# EAGLE design Shield (EAGLE 9.6.2)
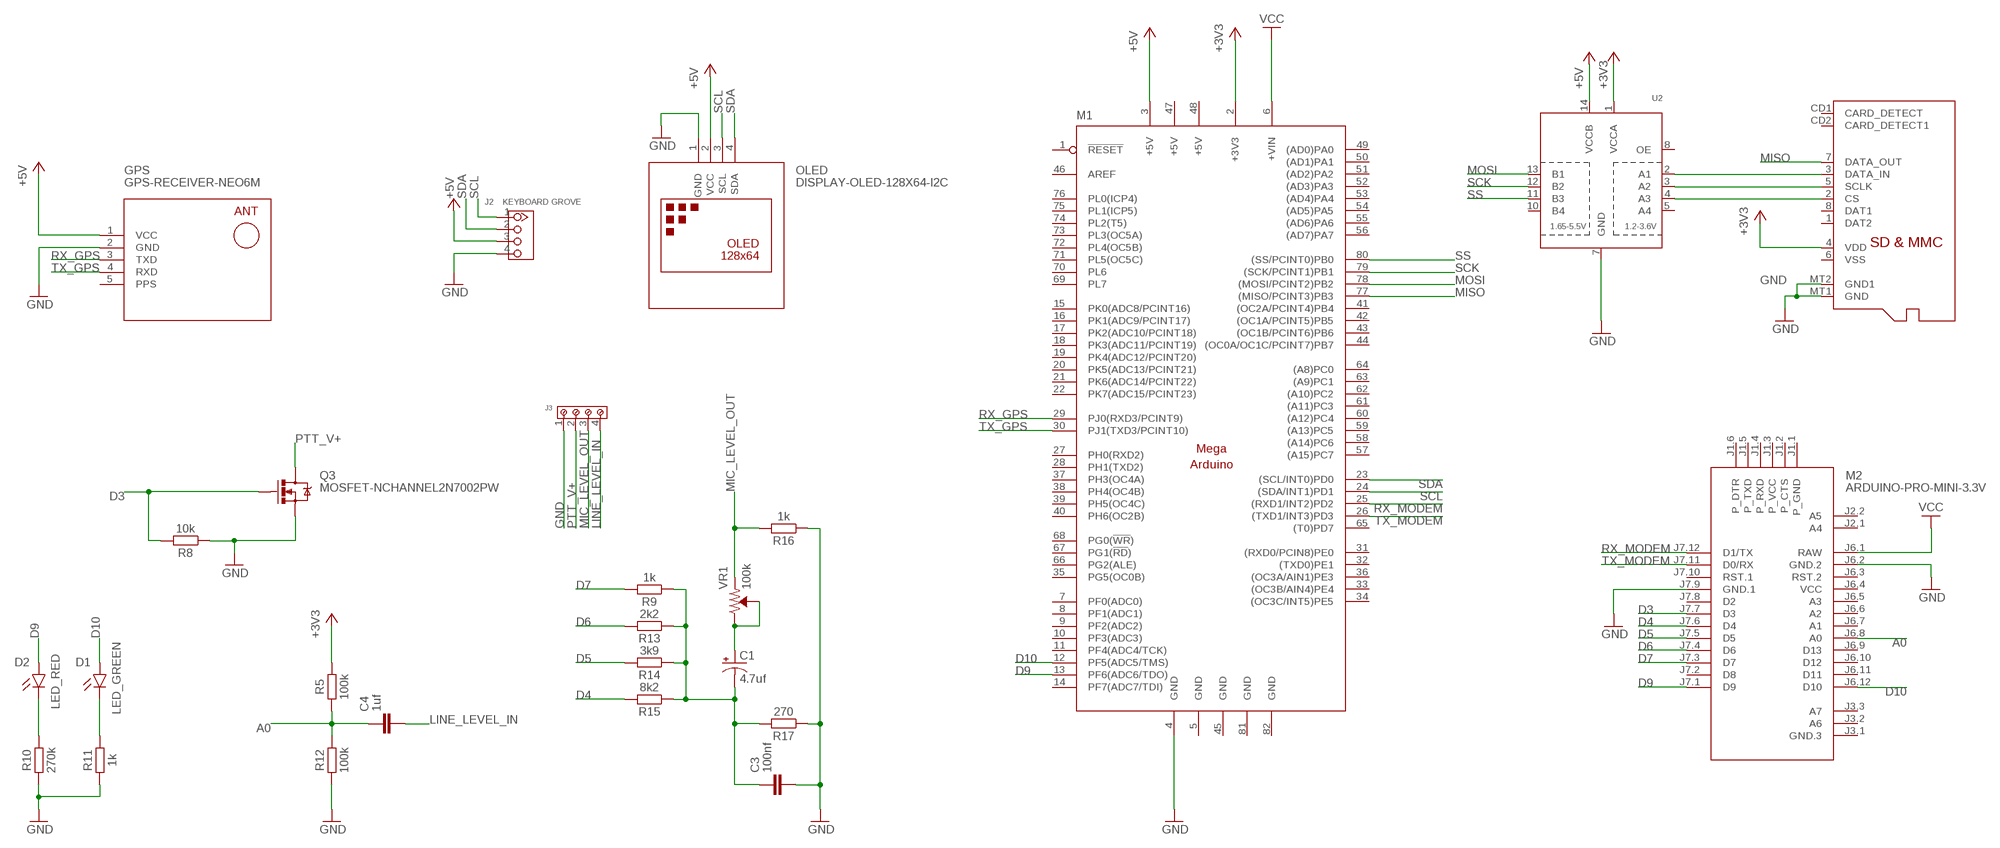
[diagram p0: schematic, sheet 1]

## Parts
C1  4.7uf  CPOL-USCT3528  [CT3528]
C3  100nf  C_CHIP-0805(2012-METRIC)  [CAPC2012X110]
C4  1uf  C_CHIP-0805(2012-METRIC)  [CAPC2012X110]
D1  LED_GREEN  CHIP-ROUND-R_0805  [LEDC2012X105N_RND-R]
D2  LED_RED  CHIP-ROUND-R_0805  [LEDC2012X105N_RND-R]
GPS  GPS-RECEIVER-NEO6M  [GPS-RECEIVER-NEO6M]
J2  KEYBOARD GROVE  GROVE-CONNECTOR-DIP-90D(4P-2.0)  [HW4-2.0-90D]
J3  691210910004  [691210910004]
M1  MEGAARDUINO_1  [MEGA_ARDUINO]
M2  ARDUINO-PRO-MINI-3.3V  [ARDUINO-PRO-MINI]
OLED  DISPLAY-OLED-128X64-I2C  [DISPLAY-OLED-128X64-I2C]
Q3  MOSFET-NCHANNEL2N7002PW  [SOT323]
R5  100k  R_CHIP-0805(2012-METRIC)  [RESC2012X65]
R8  10k  R_CHIP-0805(2012-METRIC)  [RESC2012X65]
R9  1k  R_CHIP-0805(2012-METRIC)  [RESC2012X65]
R10  270k  R_CHIP-0805(2012-METRIC)  [RESC2012X65]
R11  1k  R_CHIP-0805(2012-METRIC)  [RESC2012X65]
R12  100k  R_CHIP-0805(2012-METRIC)  [RESC2012X65]
R13  2k2  R_CHIP-0805(2012-METRIC)  [RESC2012X65]
R14  3k9  R_CHIP-0805(2012-METRIC)  [RESC2012X65]
R15  8k2  R_CHIP-0805(2012-METRIC)  [RESC2012X65]
R16  1k  R_CHIP-0805(2012-METRIC)  [RESC2012X65]
R17  270  R_CHIP-0805(2012-METRIC)  [RESC2012X65]
SD  MICROSD  [MICROSD]
U2  TXB0104PWR  [TSSOP14]
VR1  100k  TRIMPOT-SMD-3MM-CLOSED-1/8W-20%  [TRIMPOT-SMD-3MM-CLOSED]

## Nets
+3V3: M1.2(+3V3) R5.2 SD.4(VDD) U2.1(VCCA)
+5V: GPS.1(VCC) J2.3 M1.3(+5V) OLED.2(VCC) U2.14(VCCB)
A0: C4.1 M2.J6.8(A0) R5.1 R12.2
D3: M2.J7.7(D3) Q3.1(G) R8.2
D4: M2.J7.6(D4) R15.2
D5: M2.J7.5(D5) R14.2
D6: M2.J7.4(D6) R13.2
D7: M2.J7.3(D7) R9.2
D9: D2.A M1.13(PF6(ADC6/TDO)) M2.J7.1(D9)
D10: D1.A M1.12(PF5(ADC5/TMS)) M2.J6.12(D10)
GND: C3.2 GPS.2(GND) J2.4 J3.1 M1.4(GND) M2.J6.2(GND.2) M2.J7.9(GND.1) OLED.1(GND) Q3.2(S) R8.1 R10.1 R11.1 R12.1 R16.1 R17.1 SD.MT1(GND) SD.MT2(GND1) U2.7(GND)
LINE_LEVEL_IN: C4.2 J3.4
LINE_LEVEL_OUT: C1.+ VR1.2(WIPER) VR1.3(CW)
MIC_LEVEL_OUT: J3.3 R16.2 VR1.1(CCW)
MISO: M1.77((MISO/PCINT3)PB3) SD.7(DATA_OUT)
MOSI: M1.78((MOSI/PCINT2)PB2) U2.13(B1)
N$1: SD.3(DATA_IN) U2.2(A1)
N$2: C1.- C3.1 R9.1 R13.1 R14.1 R15.1 R17.2
N$3: D2.C R10.2
N$4: D1.C R11.2
N$5: SD.5(SCLK) U2.3(A2)
N$6: SD.2(CS) U2.4(A3)
PTT_V+: J3.2 Q3.3(D)
RX_GPS: GPS.3(TXD) M1.29(PJ0(RXD3/PCINT9))
RX_MODEM: M1.25((RXD1/INT2)PD2) M2.J7.12(D1/TX)
SCK: M1.79((SCK/PCINT1)PB1) U2.12(B2)
SCL: J2.1 M1.24((SDA/INT1)PD1) OLED.3(SCL)
SDA: J2.2 M1.23((SCL/INT0)PD0) OLED.4(SDA)
SS: M1.80((SS/PCINT0)PB0) U2.11(B3)
TX_GPS: GPS.4(RXD) M1.30(PJ1(TXD3/PCINT10))
TX_MODEM: M1.26((TXD1/INT3)PD3) M2.J7.11(D0/RX)
VCC: M1.6(+VIN) M2.J6.1(RAW)
Unconnected: M1.1(!RESET) M1.7(PF0(ADC0)) M1.8(PF1(ADC1)) M1.9(PF2(ADC2)) M1.10(PF3(ADC3)) M1.11(PF4(ADC4/TCK)) M1.14(PF7(ADC7/TDI)) M1.15(PK0(ADC8/PCINT16)) M1.16(PK1(ADC9/PCINT17)) M1.17(PK2(ADC10/PCINT18)) M1.18(PK3(ADC11/PCINT19)) M1.19(PK4(ADC12/PCINT20)) M1.20(PK5(ADC13/PCINT21)) M1.21(PK6(ADC14/PCINT22)) M1.22(PK7(ADC15/PCINT23)) M1.27(PH0(RXD2)) M1.28(PH1(TXD2)) M1.31((RXD0/PCIN8)PE0) M1.32((TXD0)PE1) M1.33((OC3B/AIN4)PE4) M1.34((OC3C/INT5)PE5) M1.35(PG5(OC0B)) M1.36((OC3A/AIN1)PE3) M1.37(PH3(OC4A)) M1.38(PH4(OC4B)) M1.39(PH5(OC4C)) M1.40(PH6(OC2B)) M1.41((OC2A/PCINT4)PB4) M1.42((OC1A/PCINT5)PB5) M1.43((OC1B/PCINT6)PB6) M1.44((OC0A/OC1C/PCINT7)PB7) M1.46(AREF) M1.49((AD0)PA0) M1.50((AD1)PA1) M1.51((AD2)PA2) M1.52((AD3)PA3) M1.53((AD4)PA4) M1.54((AD5)PA5) M1.55((AD6)PA6) M1.56((AD7)PA7) M1.57((A15)PC7) M1.58((A14)PC6) M1.59((A13)PC5) M1.60((A12)PC4) M1.61((A11)PC3) M1.62((A10)PC2) M1.63((A9)PC1) M1.64((A8)PC0) M1.65((T0)PD7) M1.66(PG2(ALE)) M1.67(PG1(!RD!)) M1.68(PG0(!WR!)) M1.69(PL7) M1.70(PL6) M1.71(PL5(OC5C)) M1.72(PL4(OC5B)) M1.73(PL3(OC5A)) M1.74(PL2(T5)) M1.75(PL1(ICP5)) M1.76(PL0(ICP4)) M2.J1.1(P_GND) M2.J1.2(P_CTS) M2.J1.3(P_VCC) M2.J1.4(P_RXD) M2.J1.5(P_TXD) M2.J1.6(P_DTR) M2.J2.1(A4) M2.J2.2(A5) M2.J3.1(GND.3) M2.J3.2(A6) M2.J3.3(A7) M2.J6.3(RST.2) M2.J6.5(A3) M2.J6.6(A2) M2.J6.7(A1) M2.J6.9(D13) M2.J6.10(D12) M2.J6.11(D11) M2.J7.2(D8) M2.J7.8(D2) M2.J7.10(RST.1) SD.1(DAT2) SD.6(VSS) SD.8(DAT1) SD.CD1(CARD_DETECT) SD.CD2(CARD_DETECT1) U2.5(A4) U2.8(OE) U2.10(B4)

## Power pins joined to a net without a drawn wire
+5V: M1.47(+5V) M1.48(+5V)
GND: M1.5(GND) M1.45(GND) M1.81(GND) M1.82(GND)
PPS: GPS.5(PPS)
VCC: M2.J6.4(VCC)

## Library data of the parts
C1 = adafruit:CPOL-US: POLARIZED CAPACITOR, American symbol
C3 C4 = Capacitor:C: Capacitor - Generic; CATEGORY: Capacitor
D1 = LED:CHIP-ROUND-R: LED - Generic; CATEGORY: LED; COLOR: RED; DESCRIPTION: CHIP LED ROUND; SUB-CATEGORY: CHIP; TYPE: ROUND_TOP; VALUE: LED_RED
D2 = LED:CHIP-ROUND-R: LED - Generic; CATEGORY: LED; COLOR: RED; DESCRIPTION: CHIP LED ROUND; SUB-CATEGORY: CHIP; TYPE: ROUND_TOP
GPS = diy-modules:GPS-RECEIVER-NEO6M: GPS Receiver Module based on NEO-6 device Short tutorial how to use NEO-6 module with Arduino: http://www.xarg.org/2016/06/neo6mv2-gps-module-with-arduino/ NEO-6 datasheet is available here: https://www.u-blox.com/sites/default/files/products/documents/NEO-6_DataSheet_%28GPS.G6-HW-09005%29.pdf Click here to find device on ebay.com <http://www.ebay.com/sch/gyneo6mv2>
J2 = OPL_Connector:GROVE-CONNECTOR-DIP-90D(4P-2.0): 320110034; VALUE: 4P-2.0-90D
J3 = Wurth_Connectors_WR-TBL Rising Cage Clamp:691210910004: WR-TBL Serie 2109 - 2.54 mm Horiz. Entry KIND PROPERTIES Pitch 2.54 mm MATERIAL PROPERTIES Insulator Material PA66 Insulator Flammability Rating UL94 V-0 Insulator Color Green Contact Material Brass Contact Plating Copper over Zinc Terminal Screw Material Steel Terminal Screw Plating Zinc Wire Guard Material Brass GENERAL INFORMATION Operating Temperature -40 up to +105 °C Compliance Lead free / RoHS ELECTRICAL PROPERTIES IR cULus 6 A Working Voltage [cULus] 150 V (AC) Withstanding Voltage [cULus] 1300 V (AC) Contact Resistance [cULus] 20 mΩ MECHANICAL PROPERTIES Wire Strip Length 4 up to 5 (mm) Screw M1.6 Solid Wire Section (AWG) 30 to 18 (AWG) Solid Wire Section (Metric) 0.0509 to 0.823 (mm²) Stranded Wire Section (AWG) 30 to 18 (AWG) Stranded Wire Section (Metric) 0.0509 to 0.823 (mm²) CERTIFICATION cULus Approval E315414 PACKAGING PROPERTIES Packaging Box <https://katalog.we-online.com/media/images/v2/o33231v209%20Family_WR-TBL_69121091000x.jpg> Details see: https://katalog.we-online.com/en/em/TBL_2_54_2109_HORIZONTAL_ENTRY_69121091000X Updated by Ella Wu 2019-11-12 2019(C) Wurth Elektronik; DATASHEET-URL: https://www.we-online.com/catalog/datasheet/691210910004.pdf; IR-UL: 6A; MOUNT: THT; PART-NUMBER: 691210910004; PINS: 4; PITCH: 2.54mm; TYPE: Horizontal; WIRE: 30 to 18 (AWG) 0.0509 to 0.823 (mm²); WORKING-VOLTAGE-UL: 150V (AC)
M1 = arduino:MEGAARDUINO_1: The Arduino Mega is a microcontroller board based on the ATmega1280. - 54 digital input/output pins (of which 14 can be used as PWM outputs) - 16 analog inputs - 4 UARTs (hardware serial ports) - 16 MHz crystal oscillator - USB connection - power jack - ICSP header - reset button It contains everything needed to support the microcontroller; simply connect it to a computer with a USB cable or power it with a AC-to-DC adapter or battery to get started. The Mega is compatible with most shields designed for the Arduino Duemilanove or Diecimila. http://arduino.cc/en/Main/ArduinoBoardMega
M2 = diy-modules:ARDUINO-PRO-MINI-*: Arduino Pro Mini and compatible devices More details available here: https://www.arduino.cc/en/Main/ArduinoBoardProMini Click here to find device on ebay.com <http://www.ebay.com/sch/arduino+pro+mini>
OLED = diy-modules:DISPLAY-OLED-128X64-I2C: 128x64 Dot Matrix OLED Module based on SSD1306 chip Variant with I2C interface More details available here: http://www.instructables.com/id/Monochrome-096-i2c-OLED-display-with-arduino-SSD13/ SSD1306 datasheet: https://cdn-shop.adafruit.com/datasheets/SSD1306.pdf Click here to find device on ebay.com <http://www.ebay.com/sch/oled+display+128x64+iic> Note: There are two variants: I2C and SPI. Search for the proper version.
Q3 = BeagleBone_Blue_R3:MOSFET-NCHANNEL: Common NMOSFET Parts MFG P/N Store ID Prod ID FDD8780 TRANS-09984 SI7820DN TRANS-11055 FDS6630A IC-08089 2N7002PW TRANS-11151 FQP30N06L COM-10213 TRANS-10060 BSS123LT1G TRANS-08345 BSS138 TRANS-00830 BS170 2N7000; PROD_ID: TRANS-11151
R5 R8-R17 = Resistor:R: Resistor Fixed - Generic; CATEGORY: Resistor; SUB-CATEGORY: Fixed
SD = adafruit:MICROSD: Micro-SD / Transflash card holder with SPI pinout For the 3M # 2908-05WB-MG and/or 4UCON #19656 push-push type
U2 = adafruit:TXB0104PWR: 4-Bit Bi-Directional Level Shifter 1.2V-3.6V (VCCA) to 1.65V-5.5V (VCCB) bi-directional level shifter with auto direction sensing. Max data rate - VCCA 1.8V: 20Mbps (50ns), VCCA 3.3V: 100Mbps (10ns) Digikey: 296-21929-1-ND
VR1 = SparkFun-Resistors:TRIMPOT: Trimming Potentiometer (Trimpot) Three-terminal potentiometers, with an adjustable wiper and two adjustable resistors. A pot can be used to create a configurable voltage divider, or as a variable resistor. "Trimpots" are a subset of potentiometers, usually intended for "set-and-forget" applications. They're often more delicate than standard potentiometers - rated for fewer turns. Variants PTH-KNOB - PTH Trimpot w/ finger-adjustable knob Trimpot 10K with Knob <https://www.sparkfun.com/products/9806> (COM-09806) Datasheet <http://www.sparkfun.com/datasheets/Components/General/TSR-3386.pdf> SMD-3MM-CLOSED-FRAME - SMD 3mm Square Closed-Frame Trimpot Used on e.g. EasyDriver - Stepper Motor Driver <https://www.sparkfun.com/products/12779> Datasheet <http://www.bitechnologies.com/pdfs/22.pdf> (22AR10KTR) SMD-5MM - SMD 5mm Square Closed-Frame Trimpot Used on e.g. IOIO-OTG - V2.2 <https://www.sparkfun.com/products/13613> Datasheet <http://www.vishay.com/docs/51008/ts53.pdf> (TS53YL502MR10) SMD-3MM-1/10W-25% - 3mm Square Open-Frame Trimpot Used on e.g. SparkFun Shapeoko <https://www.sparkfun.com/products/13899> Datasheet <http://www.bourns.com/docs/Product-Datasheets/TC33.pdf> (TC33X-2-103E); PROD_ID: RES-09285; VALUE: 10k

## Board
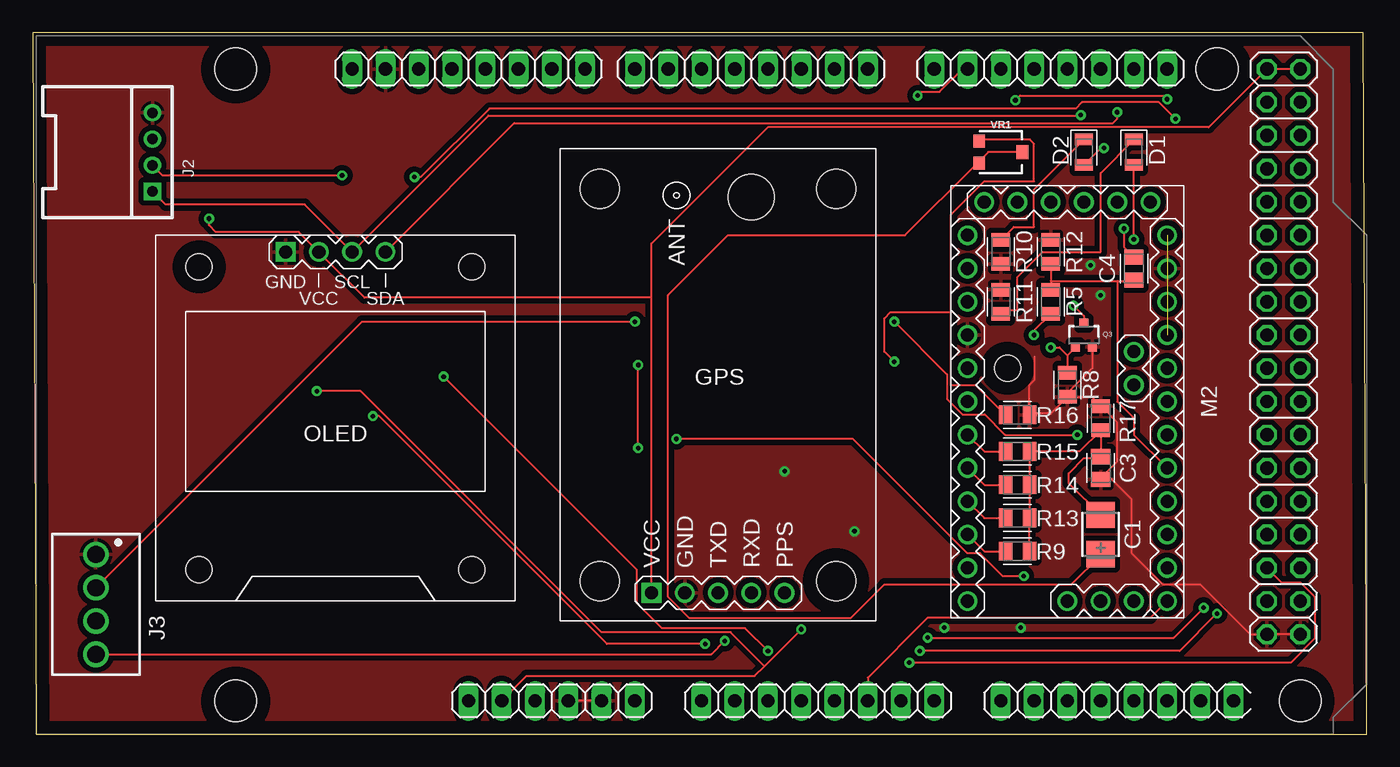
[diagram p1: board, top side]
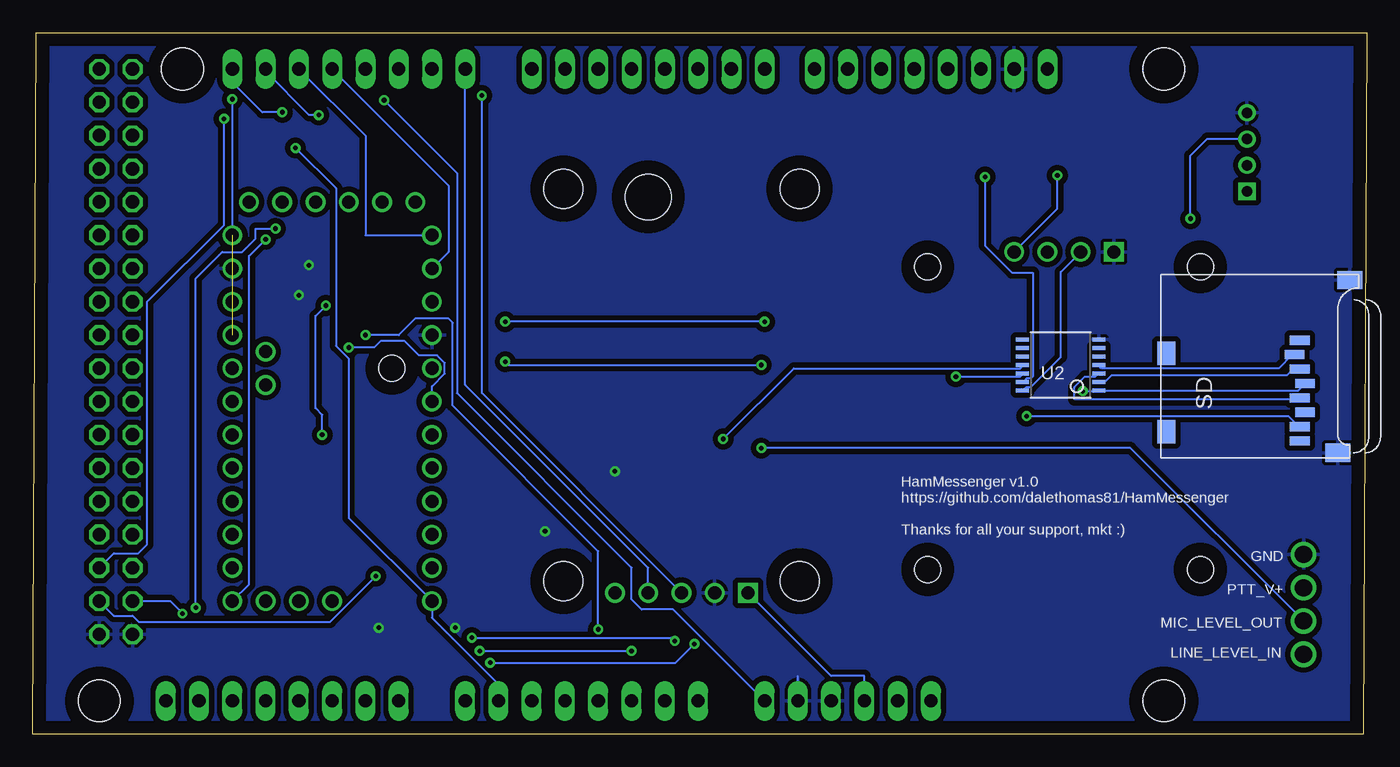
[diagram p2: board, bottom side, seen from below]

Size 101.85 x 53.57 mm. Coordinates in mm from the lower left corner, seen from the top.
Outline: 0.25,0 101.85,0 101.6,53.57 0,53.57 0.25,0
Copper layers (1*16): Top 0.035mm / dielectric 1.5mm / Bottom 0.035mm
Design rules "default": minimum track width 6mil, minimum drill 0.35mm, track to track 6mil, track to pad 6mil, pad to pad 6mil, via to via 6mil, smd to smd 6mil, copper to edge 40mil, drill to drill 6mil, minimum pad ring 10mil, minimum via ring 8mil, stop-mask expansion 4mil, vias tented up to drill 0mil, thermal gap 10mil

### Footprints (pad centres in the part's own frame; a part is rotated, then mirrored left to right if it is on the bottom)
CT3528 = smd 2 x 2.2: + 1.5,0; - -1.5,0
CAPC2012X110 = smd 1.165 x 1.465: 1 -0.875,0; 2 0.875,0
LEDC2012X105N_RND-R = smd 0.862 x 1.362: A 0.975,0; C -0.975,0
GPS-RECEIVER-NEO6M = drill 1 square: 1 -15.875,5.08 | drill 1: 2 -15.875,2.54; 3 -15.875,0; 4 -15.875,-2.54; 5 -15.875,-5.08 | hole 3: -14.986,9.017; -14.986,-9.017; 14.986,-9.017; 14.986,9.017 | hole 3.5: 14.351,-2.54
HW4-2.0-90D = drill 0.8 pad 1.27 square: 1 -3,0 | drill 0.8 pad 1.27: 2 -1,0; 3 1,0; 4 3,0
691210910004 = drill 1.3: 1 -3.81,0; 2 -1.27,0; 3 1.27,0; 4 3.81,0
MEGA_ARDUINO = drill 1.016 long: 1 33.02,2.54; 2 35.56,2.54; 3 38.1,2.54; 4 40.64,2.54; 5 43.18,2.54; 6 45.72,2.54; 7 50.8,2.54; 8 53.34,2.54; 9 55.88,2.54; 10 58.42,2.54; 11 60.96,2.54; 12 63.5,2.54; 13 66.04,2.54; 14 68.58,2.54; 15 73.66,2.54; 16 76.2,2.54; 17 78.74,2.54; 18 81.28,2.54; 19 83.82,2.54; 20 86.36,2.54; 21 88.9,2.54; 22 91.44,2.54; 23 86.36,50.8; 24 83.82,50.8; 25 81.28,50.8; 26 78.74,50.8; 27 76.2,50.8; 28 73.66,50.8; 29 71.12,50.8; 30 68.58,50.8; 31 63.5,50.8; 32 60.96,50.8; 33 58.42,50.8; 34 55.88,50.8; 35 53.34,50.8; 36 50.8,50.8; 37 48.26,50.8; 38 45.72,50.8; 39 41.91,50.8; 40 39.37,50.8; 41 36.83,50.8; 42 34.29,50.8; 43 31.75,50.8; 44 29.21,50.8; 45 26.67,50.8; 46 24.13,50.8 | drill 1.016 octagon: 47 93.98,50.8; 48 96.52,50.8; 49 93.98,48.26; 50 96.52,48.26; 51 93.98,45.72; 52 96.52,45.72; 53 93.98,43.18; 54 96.52,43.18; 55 93.98,40.64; 56 96.52,40.64; 57 93.98,38.1; 58 96.52,38.1; 59 93.98,35.56; 60 96.52,35.56; 61 93.98,33.02; 62 96.52,33.02; 63 93.98,30.48; 64 96.52,30.48; 65 93.98,27.94; 66 96.52,27.94; 67 93.98,25.4; 68 96.52,25.4; 69 93.98,22.86; 70 96.52,22.86; 71 93.98,20.32; 72 96.52,20.32; 73 93.98,17.78; 74 96.52,17.78; 75 93.98,15.24; 76 96.52,15.24; 77 93.98,12.7; 78 96.52,12.7; 79 93.98,10.16; 80 96.52,10.16; 81 93.98,7.62; 82 96.52,7.62 | hole 3.2: 15.24,50.8; 15.24,2.54; 90.17,50.8; 96.52,2.54 | hole 2: 74.168,27.94
ARDUINO-PRO-MINI = drill 1: J1.1 -15.24,6.35; J1.2 -15.24,3.81; J1.3 -15.24,1.27; J1.4 -15.24,-1.27; J1.5 -15.24,-3.81; J1.6 -15.24,-6.35; J2.1 -1.27,5.08; J2.2 -3.81,5.08; J3.1 15.24,0; J3.2 15.24,2.54; J3.3 15.24,5.08; J6.1 -12.7,7.62; J6.2 -10.16,7.62; J6.3 -7.62,7.62; J6.4 -5.08,7.62; J6.5 -2.54,7.62; J6.6 0,7.62; J6.7 2.54,7.62; J6.8 5.08,7.62; J6.9 7.62,7.62; J6.10 10.16,7.62; J6.11 12.7,7.62; J6.12 15.24,7.62; J7.1 15.24,-7.62; J7.2 12.7,-7.62; J7.3 10.16,-7.62; J7.4 7.62,-7.62; J7.5 5.08,-7.62; J7.6 2.54,-7.62; J7.7 0,-7.62; J7.8 -2.54,-7.62; J7.9 -5.08,-7.62; J7.10 -7.62,-7.62; J7.11 -10.16,-7.62; J7.12 -12.7,-7.62
DISPLAY-OLED-128X64-I2C = drill 1 square: 1 -3.81,12.7 | drill 1: 2 -1.27,12.7; 3 1.27,12.7; 4 3.81,12.7 | hole 2: -10.414,11.557; 10.414,11.557; 10.414,-11.557; -10.414,-11.557
SOT323 = smd 0.7 x 0.7: 1 -0.65,-0.925; 2 0.65,-0.925; 3 0,0.925
RESC2012X65 = smd 1.031 x 1.42: 1 -0.919,0; 2 0.919,0
MICROSD = smd 0.7 x 1.5: 1 9,-10.64; 2 7.9,-10.24; 3 6.8,-10.64; 4 5.7,-11.04; 5 4.6,-10.64; 6 3.5,-11.04; 7 2.4,-10.64; 8 1.3,-10.64 | smd 1.8 x 1.4: CD1 2,-0.44; CD2 8,-0.44 | smd 1.4 x 1.9: MT1 0.4,-13.54; MT2 13.6,-14.44
TSSOP14 = smd 0.305 x 0.991: 1 -1.95,-2.918; 2 -1.3,-2.918; 3 -0.65,-2.918; 4 0,-2.918; 5 0.65,-2.918; 6 1.3,-2.918; 7 1.95,-2.918; 8 1.95,2.918; 9 1.3,2.918; 10 0.65,2.918; 11 0,2.918; 12 -0.65,2.918; 13 -1.3,2.918; 14 -1.95,2.918
TRIMPOT-SMD-3MM-CLOSED = smd 1 x 0.9: 1 -0.85,-1.65; 3 0.85,-1.65 | smd 1.1 x 0.9: 2 0,1.65

### Placement (x,y rotation side)
C1  81.53,15.24 270 top
C3  81.53,20.32 270 top
C4  84.07,35.56 90 top
D1  84.07,44.45 270 top
D2  80.26,44.45 270 top
GPS  52.32,26.67 90 top
J2  9.14,44.45 90 top
J3  4.83,9.91 270 top
M1  0.25,0 0 top
M2  78.99,25.4 270 top
OLED  23.11,24.13 0 top
Q3  80.26,30.48 0 top
R5  77.72,33.02 270 top
R8  78.99,26.67 90 top
R9  75.18,13.97 180 top
R10  73.91,36.83 90 top
R11  73.91,33.02 270 top
R12  77.72,36.83 270 top
R13  75.18,16.51 180 top
R14  75.18,19.05 180 top
R15  75.18,21.59 180 top
R16  75.18,24.38 180 top
R17  81.53,24.13 270 top
SD  15.75,21.08 90 bottom
U2  23.37,28.19 90 bottom
VR1  73.91,44.45 270 top

### Tracks (layer width: path | path; a pad name or v marks a point on that pad's centre or on a via)
+3V3  (via drill 0.35)
  Top 0.152: 55.86,5.19 55.12,4.45 37.72,4.45 M1.2 | 55.86,5.19 v58.67,8 | v76.45,30.48 76.45,30.83 R5.2 | v21.69,26.19 25.02,26.19 43.43,7.78 53.28,7.78 55.86,5.19
  Bottom 0.152: v58.67,8 58.67,13.97 69.79,25.08 69.79,31.43 70.1,31.75 72.64,31.75 73.91,30.48 v76.45,30.48 | v21.69,26.19 20.57,26.19 U2.1 20.43,26.26 5.23,26.26 SD.4
+5V  (via drill 0.35)
  Top 0.152: M1.48 M1.47 89.79,46.35 56.13,46.35 47.24,37.47 47.24,33.34 | GPS.1 47.24,33.34 | 47.24,33.34 25.34,33.34 OLED.2 20.32,38.35 13.97,38.35 13.46,38.86 v13.46,39.37
  Bottom 0.152: GPS.1 40.89,4.45 38.35,4.45 M1.3 | U2.14 26.13,26.35 25.97,26.51 25.65,26.51 23.37,28.8 23.37,35.31 OLED.2 | v13.46,39.37 13.46,44.2 12.19,45.47 9.16,45.47 J2.3
A0
  Top 0.152: R12.2 77.72,34.61 | 77.72,34.61 R5.1 | 77.72,34.61 82.8,34.61 | 82.8,34.61 84.07,34.61 C4.1 | M2.J6.8 84.07,22.86 84.07,24.13 82.8,25.4 82.8,34.61
D3  (via drill 0.35)
  Top 0.152: Q3.1 78.99,28.93 | 78.99,28.93 R8.2 | v77.72,29.53 78.4,29.53 78.99,28.93
  Bottom 0.152: M2.J7.7 71.37,26.55 70.39,27.53 70.39,28.35 70.97,28.92 72.36,28.92 73.47,30.03 75.29,30.03 75.79,29.53 v77.72,29.53
D4
  Top 0.152: M2.J7.6 72.64,21.59 R15.2
D5
  Top 0.152: M2.J7.5 72.64,19.05 R14.2
D6
  Top 0.152: M2.J7.4 72.64,16.51 R13.2
D7
  Top 0.152: M2.J7.3 72.64,13.97 R9.2
D9  (via drill 0.35)
  Top 0.152: v81.79,44.77 81.56,44.77 D2.A
  Bottom 0.152: M1.13 66.29,3.81 71.37,8.89 M2.J7.1 77.72,16.51 77.72,28.67 78.71,29.65 78.71,41.69 v81.79,44.77
D10  (via drill 0.35)
  Top 0.152: v84.07,37.78 D1.A | M1.12 63.75,4.32 68.33,8.89 85.34,8.89 M2.J6.12
  Bottom 0.152: v84.07,37.78 85.34,36.51 85.34,11.43 M2.J6.12
GND  (via drill 0.35)
  Top 0.152: M1.5 M1.4 | M1.82 M1.81 92.96,7.62 89.15,11.43 86.3,11.43 83.92,13.81 83.92,17.94 82.18,19.67 81.53,19.67 | 81.53,25.08 R17.1 | R8.1 78.99,26.04 80.91,27.96 Q3.2 | 76.51,28.81 76.51,27.07 76.1,26.66 R16.1 76.2,24.48 77.72,24.48 R8.1 | C3.2 81.53,19.56 82.8,20.83 82.8,23.81 81.53,25.08 | R8.1 80.87,25.75 81.53,25.08
  Bottom 0.152: M1.5 43.43,4.45
  other vias: 80.77,35.81 81.53,33.53 75.44,8.13 69.6,8.13 62.74,15.49 57.4,20.07
  pour Top (isolate 0.406): 0.25,53.34 0.25,0 101.85,0 101.85,53.34
  pour Bottom (isolate 0.406): 0.25,53.59 101.85,53.59 101.85,0 0.25,0
LINE_LEVEL_IN  (via drill 0.35)
  Top 0.152: J3.4 51.82,6.1 v52.83,7.11 | v68.33,7.37 87.12,7.37 v89.41,9.65 | v83.31,38.61 83.31,37.2 C4.2
  Bottom 0.152: v89.41,9.65 89.41,34.8 87.38,36.83 85.85,36.83 84.84,37.85 84.84,38.61 v83.31,38.61 | v52.83,7.11 53.09,7.37 v68.33,7.37
LINE_LEVEL_OUT
  Top 0.152: VR1.2 72.96,44.45 72.33,43.81 VR1.3 72.01,43.5 66.61,38.1 53.09,38.1 48.51,33.53 48.51,10.48 50.1,8.89 62.48,8.89 65.02,11.43 79.31,11.43 81.53,13.65 C1.+
MIC_LEVEL_OUT  (via drill 0.35)
  Top 0.152: 70.1,32.23 70.1,26.67 71.98,26.67 R16.2 | 70.1,32.23 70.1,39.69 72.64,42.23 76.45,42.23 76.45,45.09 76.14,45.4 72.33,45.4 VR1.1 | v46.23,21.84 v46.23,28.19 | 70.1,32.23 65.5,32.23 65.02,31.75 65.02,29.21 v65.79,28.45
  Bottom 0.152: J3.3 18.03,21.84 v46.23,21.84 | v46.23,28.19 65.53,28.19 v65.79,28.45
MISO  (via drill 0.35)
  Top 0.152: v25.97,24.29 26.45,24.29 43.85,6.89 v51.34,6.89 | v66.93,5.46 96.04,5.46 97.89,7.3 97.89,10.48 96.77,11.59 95.34,11.59 M1.77
  Bottom 0.152: SD.7 5.19,23.48 6,24.29 v25.97,24.29 | v51.34,6.89 52.77,5.46 v66.93,5.46
MOSI  (via drill 0.35)
  Top 0.152: v29.15,42.55 29.62,42.55 34.86,47.78 79.63,47.78 80.11,48.26 85.98,48.26 v87.25,46.99
  Bottom 0.152: v29.15,42.55 29.15,37.31 27.08,35.24 25.5,35.24 25.5,27.3 25.65,27.15 25.97,27.15 26.13,26.99 U2.13 | v87.25,46.99 87.25,38.89 93.12,33.02 93.12,14.48 93.79,13.81 95.66,13.81 M1.78
N$1
  Bottom 0.152: U2.2 20,26.89 19.5,27.4 6.1,27.4 5.61,27.88 SD.3
N$2
  Top 0.152: R9.1 R13.1 R14.1 R15.1 79.91,21.59 R17.2 C3.1 81.53,21.08 80.26,21.08 79.11,19.93 79.11,19.16 C1.-
N$3
  Top 0.152: D2.C 80.26,45.4 76.45,41.59 76.45,38.73 74.9,38.73 R10.2
N$4
  Top 0.152: D1.C 84.07,45.4 81.53,42.86 81.53,36.83 77.09,36.83 75.18,34.92 75.18,32.38 73.91,32.38 R11.2
N$5
  Bottom 0.152: U2.3 20.57,27.46 20.73,27.3 21.53,27.3 22.32,26.51 22.32,25.56 5.21,25.56 SD.5
N$6
  Bottom 0.152: SD.2 5.69,28.98 6.73,27.94 20.26,27.94 20.42,28.1 U2.4
PTT_V+  (via drill 0.35)
  Top 0.152: J3.2 25.15,31.5 v45.97,31.5 | v65.79,31.5 69.8,27.48 69.8,25.59 70.97,24.42 72.68,24.42 74.24,22.86 v79.76,22.86 | v79.47,32.73 80.26,31.94 Q3.3
  Bottom 0.152: v45.97,31.5 v65.79,31.5 | v79.76,22.86 79.76,24.38 80.26,24.89 80.26,31.94 v79.47,32.73
RX_GPS  (via drill 0.35)
  Top 0.152: v67.56,48.77 67.84,49.05 69.24,49.05 71,50.8 M1.29
  Bottom 0.152: GPS.3 67.56,26.04 v67.56,48.77
RX_MODEM
  Bottom 0.152: M2.J7.12 76.45,38.1 76.45,45.72 M1.25
SCK  (via drill 0.35)
  Top 0.152: v31.37,27.3 46.13,12.54 46.13,10 48.04,8.1 54.39,8.1 v56.13,6.35 | v67.72,6.35 87.57,6.35 v90.42,9.21
  Bottom 0.152: v31.37,27.3 26.45,27.3 26.29,27.46 U2.12 | v67.72,6.35 v56.13,6.35 | v90.42,9.21 91.38,10.16 M1.79
SCL  (via drill 0.35)
  Top 0.152: v80.01,47.28 80.01,47.24 34.8,47.24 OLED.3 20.77,40.45 18.29,40.45 10.14,40.45 J2.1
  Bottom 0.152: v80.01,47.28 80.74,47.28 84.07,50.62 M1.24
SDA  (via drill 0.35)
  Top 0.152: OLED.4 36.77,46.67 82.49,46.67 82.8,46.99 v82.8,47.5 | v23.62,42.67 9.92,42.67 J2.2
  Bottom 0.152: v82.8,47.5 84.33,47.5 86.61,49.78 M1.23 | OLED.4 23.62,40.13 v23.62,42.67
SS  (via drill 0.35)
  Top 0.152: v49.15,22.54 62.64,22.54 71.37,13.81 72.33,13.81 74.07,12.06 v75.66,12.06
  Bottom 0.152: v49.15,22.54 43.75,27.94 26.45,27.94 26.29,28.1 U2.11 | v75.66,12.06 79.15,8.57 93.76,8.57 94.23,9.05 95.66,9.05 M1.80
TX_GPS
  Bottom 0.152: M1.30 68.83,26.67 54.86,12.7 GPS.4
TX_MODEM
  Bottom 0.152: M2.J7.11 70.1,36.83 70.1,41.91 M1.26
VCC  (via drill 0.35)  (1 unrouted)
  Top 0.152: v75.03,48.42 75.38,48.77 86.61,48.77 v86.61,48.49
  Bottom 0.152: M1.6 52.96,9.53 55.37,9.53 56.13,10.29 56.13,12.7 69.47,26.04 69.47,42.86 v75.03,48.42 | v86.61,48.49 M2.J6.1

### Text on the board
bPlace: HamMessenger v1.0 / https://github.com/dalethomas81/HamMessenger / / Thanks for all your support, mkt :) | GND | PTT_V+ | MIC_LEVEL_OUT | LINE_LEVEL_IN